# Altium project Beethoven-clock_Brain-PCB.PrjPcb
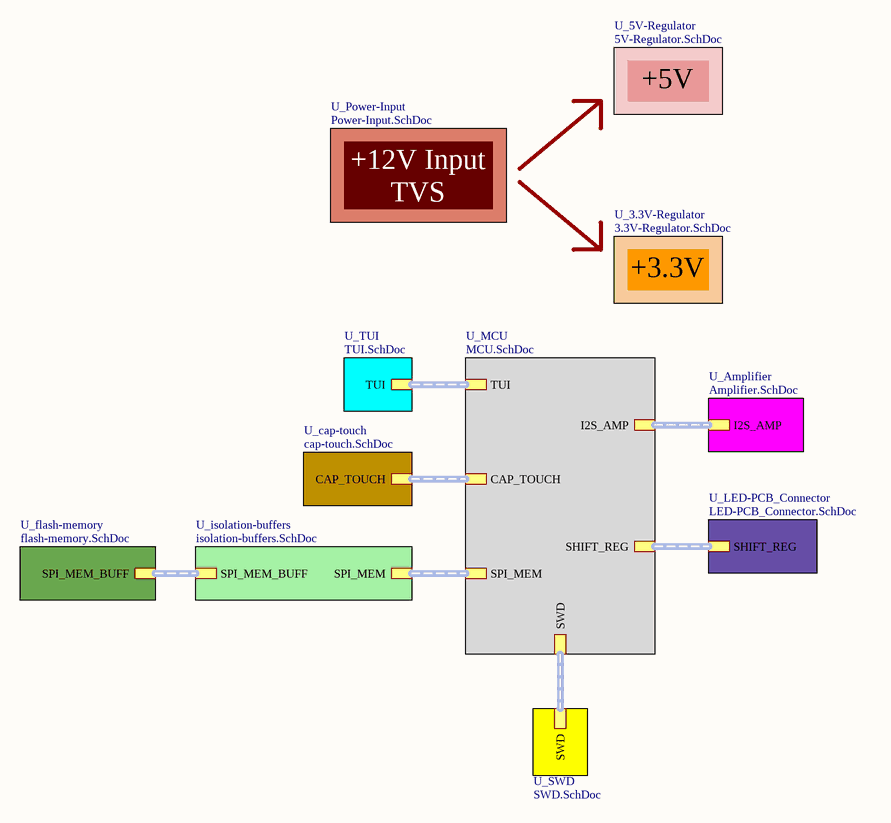
[diagram p0: Brain-PCB_MASTER.SchDoc]
12 sheets, 137 parts. Net scope: hierarchical (ports join the sheet entries above them; power ports are global).
Board file: Beethoven-Clock_Brain-PCB.PcbDoc
Sheets:
  Brain-PCB_MASTER.SchDoc
    U_cap-touch = Cap-Touch.SchDoc
    U_isolation-buffers = Isolation-Buffers.SchDoc
    U_flash-memory = Flash-Memory.SchDoc
    U_SWD = SWD.SchDoc
    U_TUI = TUI.SchDoc
    U_Power-Input = Power-Input.SchDoc
    U_3.3V-Regulator = 3.3V-Regulator.SchDoc
    U_5V-Regulator = 5V-Regulator.SchDoc
    U_LED-PCB_Connector = LED-PCB_Connector.SchDoc
    U_Amplifier = Amplifier.SchDoc
    U_MCU = MCU.SchDoc

## Sheet Brain-PCB_MASTER.SchDoc
size B; SheetNumber: 1; SheetTotal: 12

### Sub-sheets
U_3.3V-Regulator = 3.3V-Regulator.SchDoc: no entries
U_5V-Regulator = 5V-Regulator.SchDoc: no entries
U_Amplifier = Amplifier.SchDoc: I2S_AMP (harness I2S_AMP)
U_cap-touch = cap-touch.SchDoc: CAP_TOUCH (harness CAP_TOUCH)
U_flash-memory = flash-memory.SchDoc: SPI_MEM_BUFF (harness SPI_MEM_BUFF)
U_isolation-buffers = isolation-buffers.SchDoc: SPI_MEM (harness SPI_MEM), SPI_MEM_BUFF (harness SPI_MEM_BUFF)
U_LED-PCB_Connector = LED-PCB_Connector.SchDoc: SHIFT_REG (harness SHIFT_REG)
U_MCU = MCU.SchDoc: SPI_MEM (harness SPI_MEM), I2S_AMP (harness I2S_AMP), SHIFT_REG (harness SHIFT_REG), TUI (harness TUI), SWD (harness SWD), CAP_TOUCH (harness CAP_TOUCH)
U_Power-Input = Power-Input.SchDoc: no entries
U_SWD = SWD.SchDoc: SWD (harness SWD)
U_TUI = TUI.SchDoc: TUI (harness TUI)

### Buses and harness runs
harness sheet U_Amplifier/I2S_AMP = sheet U_MCU/I2S_AMP
harness sheet U_cap-touch/CAP_TOUCH = sheet U_MCU/CAP_TOUCH
harness sheet U_flash-memory/SPI_MEM_BUFF = sheet U_isolation-buffers/SPI_MEM_BUFF
harness sheet U_isolation-buffers/SPI_MEM = sheet U_MCU/SPI_MEM
harness sheet U_LED-PCB_Connector/SHIFT_REG = sheet U_MCU/SHIFT_REG
harness sheet U_MCU/SWD = sheet U_SWD/SWD
harness sheet U_MCU/TUI = sheet U_TUI/TUI

### Notes on the sheet
- +5V
- +12V Input
  TVS
- +3.3V

## Sheet Cap-Touch.SchDoc
size A; SheetNumber: 8; SheetTotal: 12
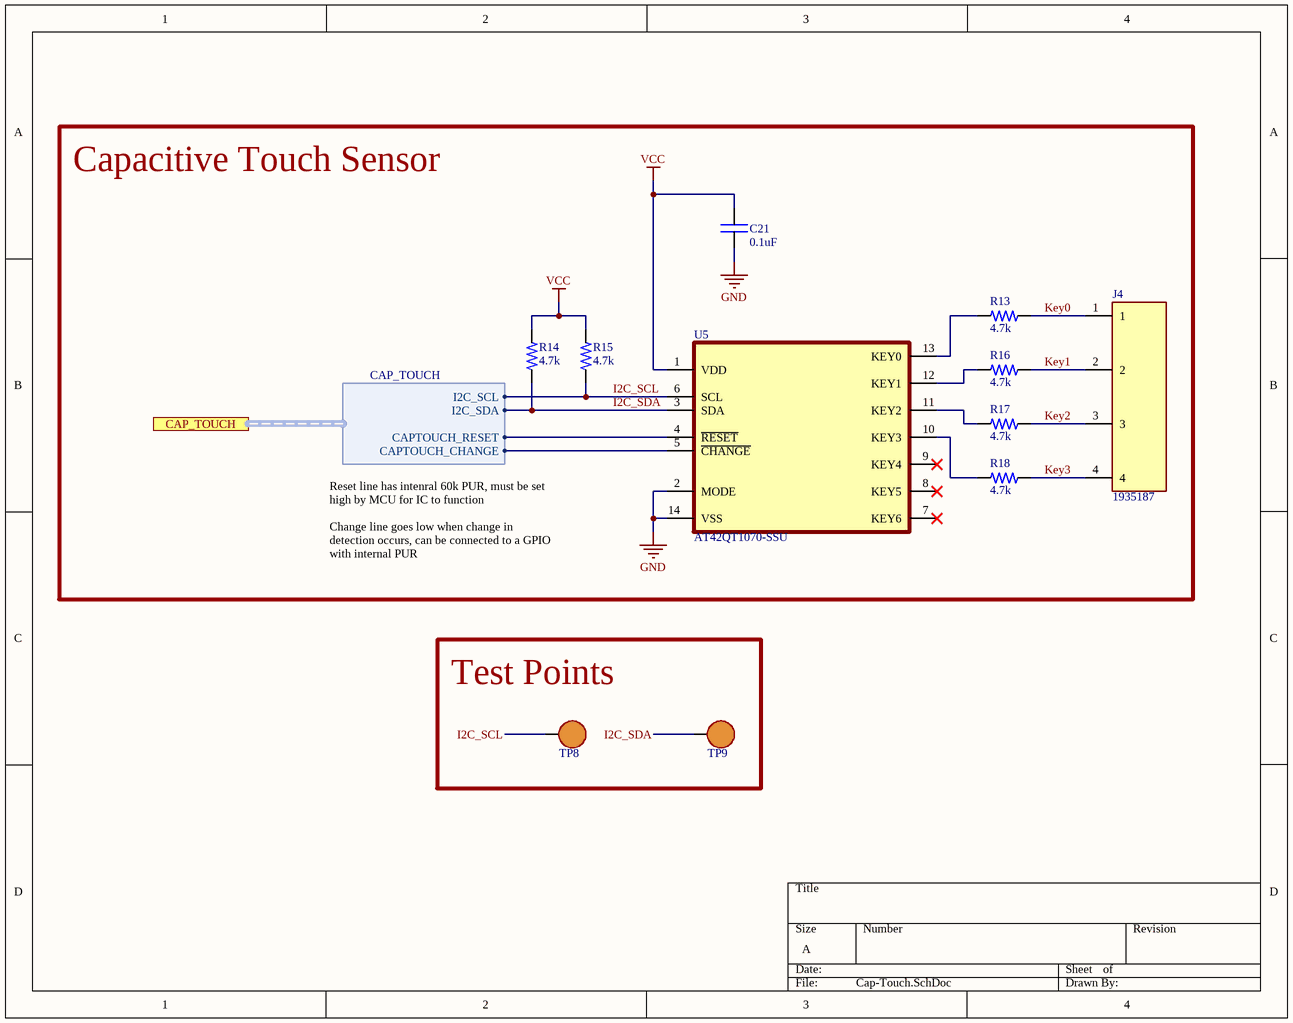
[diagram p1: Cap-Touch.SchDoc]

### Parts
C21  value 0.1uF  [0402C]  (hidden comment: CAP)
J4  1935187  [1935187]
R13  value 4.7k  [0402R]  (hidden comment: RES)
R14  value 4.7k  [0402R]  (hidden comment: RES)
R15  value 4.7k  [0402R]  (hidden comment: RES)
R16  value 4.7k  [0402R]  (hidden comment: RES)
R17  value 4.7k  [0402R]  (hidden comment: RES)
R18  value 4.7k  [0402R]  (hidden comment: RES)
TP8  RCWCTE  [RCWCTE]  (value not drawn)
TP9  RCWCTE  [RCWCTE]  (value not drawn)
U5  AT42QT1070-SSU  [14-SOIC]

### Blocks framed on the sheet
Capacitive Touch Sensor: C21 J4 R13-R18 U5
Test Points: TP8 TP9

### Ports
CAP_TOUCH (harness CAP_TOUCH, see Brain-PCB_MASTER[3B], MCU[1C])

### Harnesses
CAP_TOUCH: I2C_SCL, I2C_SDA, CAPTOUCH_RESET, CAPTOUCH_CHANGE

### Nets
GND: C21.1 U5.2(MODE) U5.14(VSS)
VCC: C21.2 R14.2 R15.2 U5.1(VDD)
CAPTOUCH_CHANGE: U5.5(~{CHANGE}) ; port CAP_TOUCH.CAPTOUCH_CHANGE
CAPTOUCH_RESET: U5.4(~{RESET}) ; port CAP_TOUCH.CAPTOUCH_RESET
I2C_SCL: R15.1 TP8.1 U5.6(SCL) ; port CAP_TOUCH.I2C_SCL
I2C_SDA: R14.1 TP9.1 U5.3(SDA) ; port CAP_TOUCH.I2C_SDA
Key0: J4.1 R13.1
Key1: J4.2 R16.1
Key2: J4.3 R17.1
Key3: J4.4 R18.1
NetR13_2: R13.2 U5.13(KEY0)
NetR16_2: R16.2 U5.12(KEY1)
NetR17_2: R17.2 U5.11(KEY2)
NetR18_2: R18.2 U5.10(KEY3)

Not connected (* = marked no-connect by the designer): U5 7(KEY6)* 8(KEY5)* 9(KEY4)*

### Notes on the sheet
- Reset line has intenral 60k PUR, must be set high by MCU for IC to function
  Change line goes low when change in detection occurs, can be connected to a GPIO with internal PUR

### Library data of the parts
C21 = CAP: Capacitor; MFR: Murata Electronics; MFR PN: GRM155R71C104KA88J; Type: SMD; Vendor: *; Vendor PN: *; Vendor Link: *
J4 = SCREW CONN 4 POS: Fixed Terminal Blocks PT 1.5/4-5.0-H; MFR: Phoenix Contact; MFR PN: 1935187; Type: TH
R13-R18 = RES: Resistor; MFR PN: AC0402FR-134K7L; MFR: YAGEO; Vendor: *; Vendor PN: *; Vendor Link: *; Type: SMD
TP8 TP9 = TEST POINT: Test Point, Surface Mount; MFR: KOA Speer Electronics, Inc.; MFR PN: RCWCTE; Type: SMD
U5 = AT42QT1070-SSU: Capacitive Touch Buttons 14-SOIC; MFR: Microchip; Value: *; MFR PN: AT42QT1070-SSU; Type: SMD

## Sheet Isolation-Buffers.SchDoc
size B; SheetNumber: 9; SheetTotal: 12
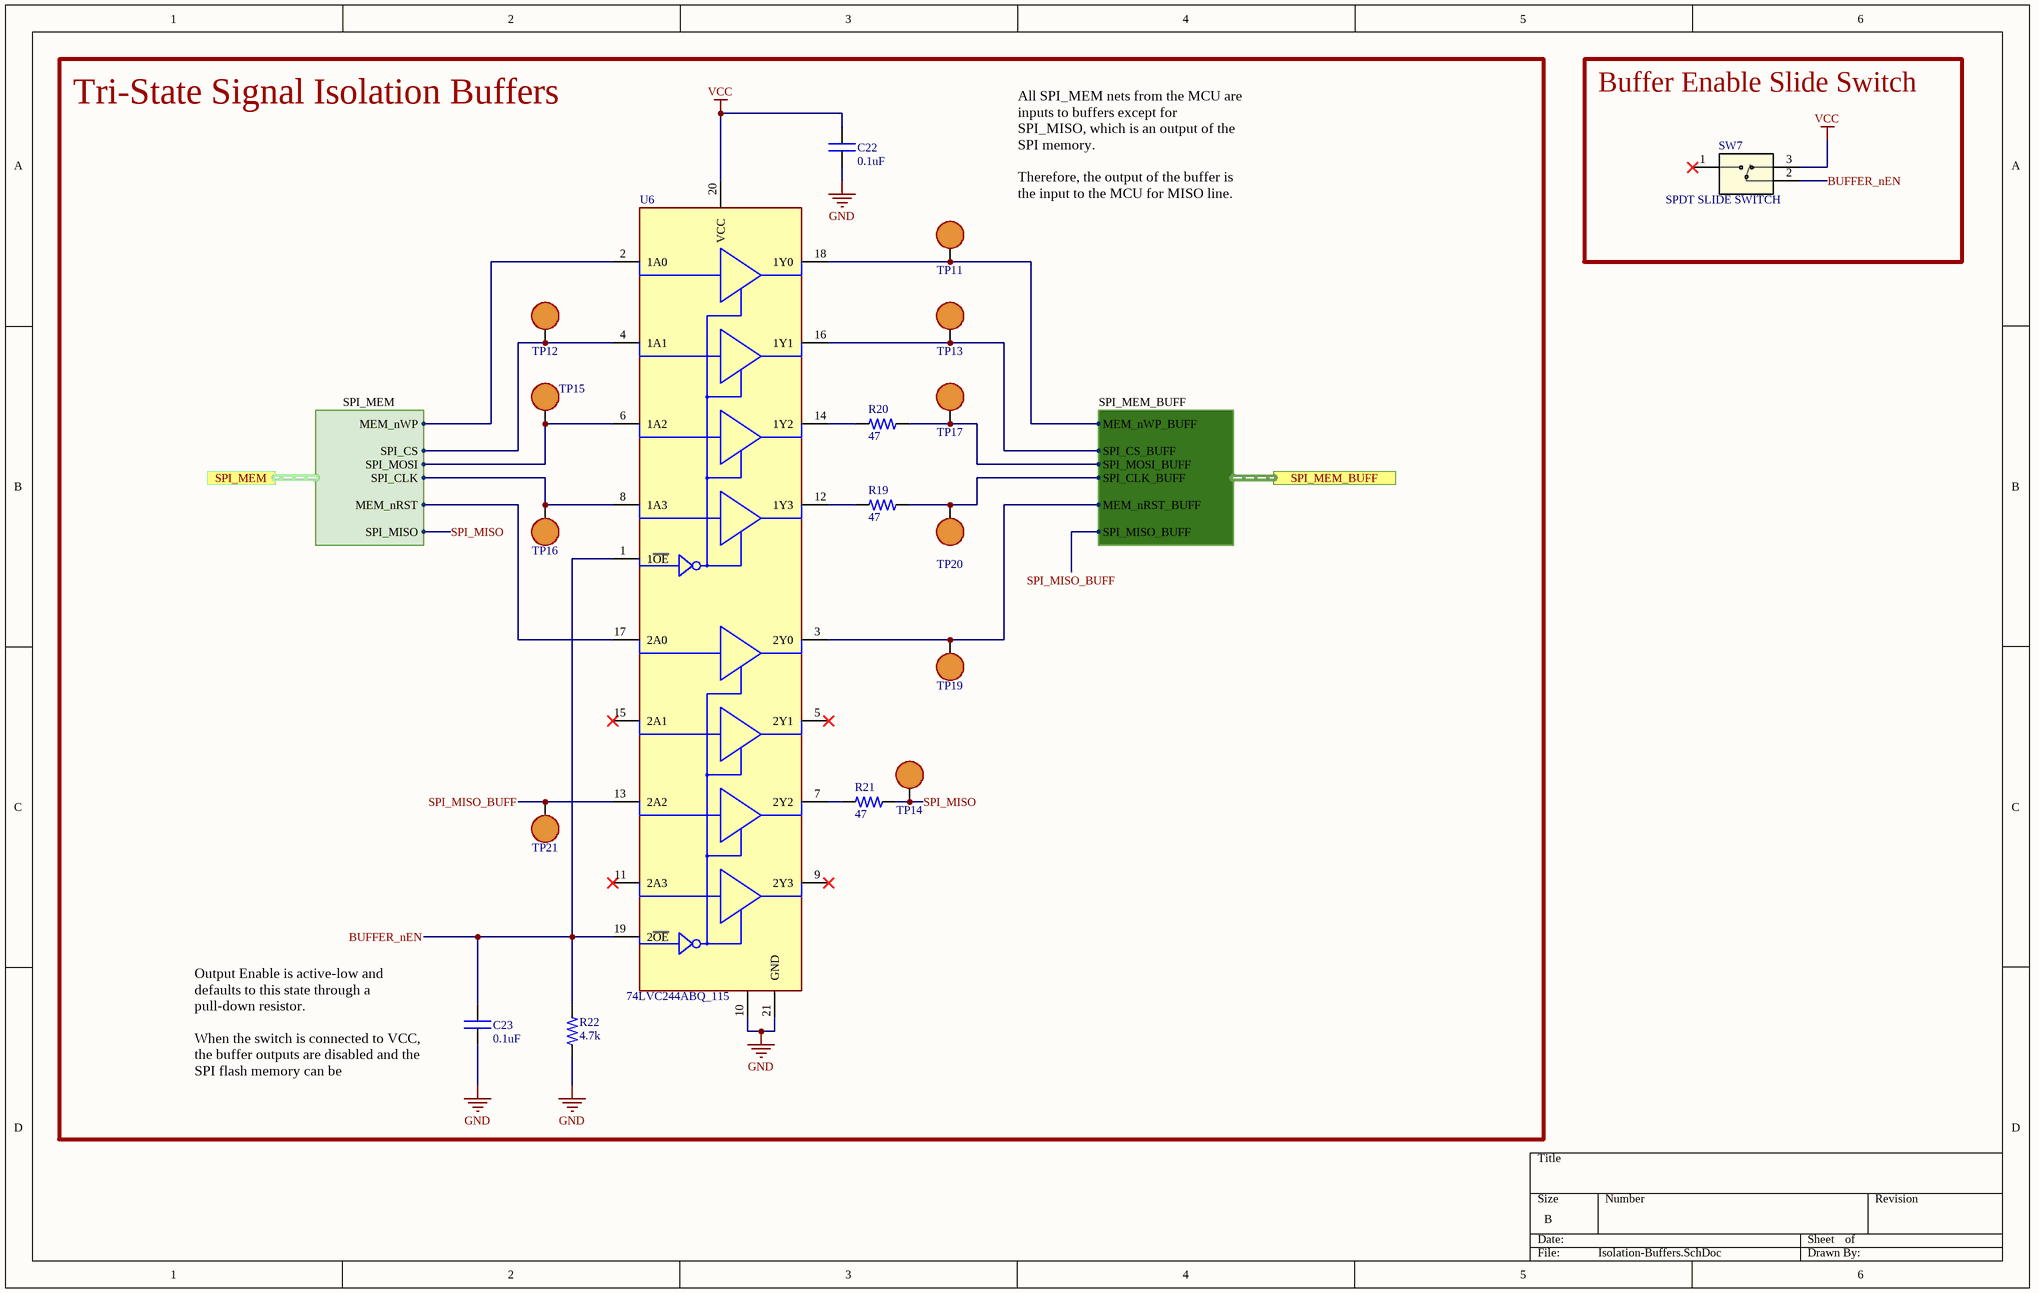
[diagram p2: Isolation-Buffers.SchDoc]

### Parts
C22  value 0.1uF  [0402C]  (hidden comment: CAP)
C23  value 0.1uF  [0402C]  (hidden comment: CAP)
R19  value 47  [0402R]  (hidden comment: RES)
R20  value 47  [0402R]  (hidden comment: RES)
R21  value 47  [0402R]  (hidden comment: RES)
R22  value 4.7k  [0402R]  (hidden comment: RES)
SW7  SPDT SLIDE SWITCH  [JS102011SCQN]
TP11  RCWCTE  [RCWCTE]  (value not drawn)
TP12  RCWCTE  [RCWCTE]  (value not drawn)
TP13  RCWCTE  [RCWCTE]  (value not drawn)
TP14  RCWCTE  [RCWCTE]  (value not drawn)
TP15  RCWCTE  [RCWCTE]  (value not drawn)
TP16  RCWCTE  [RCWCTE]  (value not drawn)
TP17  RCWCTE  [RCWCTE]  (value not drawn)
TP19  RCWCTE  [RCWCTE]  (value not drawn)
TP20  RCWCTE  [RCWCTE]  (value not drawn)
TP21  RCWCTE  [RCWCTE]  (value not drawn)
U6  74LVC244ABQ_115  [20-VFQN-EP]

### Blocks framed on the sheet
Tri-State Signal Isolation Buffers: C22 C23 R19-R22 TP11-TP17 TP19-TP21 U6
Buffer Enable Slide Switch: SW7

### Ports
SPI_MEM (harness SPI_MEM, see Brain-PCB_MASTER[3C], MCU[1A]), SPI_MEM_BUFF (harness SPI_MEM_BUFF, see Brain-PCB_MASTER[2C], Flash-Memory[4A])

### Harnesses
SPI_MEM: SPI_CLK, SPI_MISO, SPI_MOSI, SPI_CS, MEM_nWP, MEM_nRST
SPI_MEM_BUFF: SPI_CLK_BUFF, SPI_MISO_BUFF, SPI_MOSI_BUFF, SPI_CS_BUFF, MEM_nWP_BUFF, MEM_nRST_BUFF

### Nets
GND: C22.2 C23.1 R22.1 U6.10(GND) U6.21(GND)
VCC: C22.1 SW7.3 U6.20(VCC)
BUFFER_nEN: C23.2 R22.2 SW7.2 U6.1(1~{OE}) U6.19(2~{OE})
MEM_nRST: U6.17(2A0) ; port SPI_MEM.MEM_nRST
MEM_nRST_BUFF: TP19.1 U6.3(2Y0) ; port SPI_MEM_BUFF.MEM_nRST_BUFF
MEM_nWP: U6.2(1A0) ; port SPI_MEM.MEM_nWP
MEM_nWP_BUFF: TP11.1 U6.18(1Y0) ; port SPI_MEM_BUFF.MEM_nWP_BUFF
SPI_CLK: TP16.1 U6.8(1A3) ; port SPI_MEM.SPI_CLK
SPI_CLK_BUFF: R19.1 TP20.1 ; port SPI_MEM_BUFF.SPI_CLK_BUFF
SPI_CS: TP12.1 U6.4(1A1) ; port SPI_MEM.SPI_CS
SPI_CS_BUFF: TP13.1 U6.16(1Y1) ; port SPI_MEM_BUFF.SPI_CS_BUFF
SPI_MISO: R21.1 TP14.1 ; port SPI_MEM.SPI_MISO
SPI_MISO_BUFF: TP21.1 U6.13(2A2) ; port SPI_MEM_BUFF.SPI_MISO_BUFF
SPI_MOSI: TP15.1 U6.6(1A2) ; port SPI_MEM.SPI_MOSI
SPI_MOSI_BUFF: R20.1 TP17.1 ; port SPI_MEM_BUFF.SPI_MOSI_BUFF
NetR19_2: R19.2 U6.12(1Y3)
NetR20_2: R20.2 U6.14(1Y2)
NetR21_2: R21.2 U6.7(2Y2)

Not connected (* = marked no-connect by the designer): SW7 1*; U6 5(2Y1)* 9(2Y3)* 11(2A3)* 15(2A1)*

### Notes on the sheet
- All SPI_MEM nets from the MCU are inputs to buffers except for SPI_MISO, which is an output of the SPI memory.
  Therefore, the output of the buffer is the input to the MCU for MISO line.
- Output Enable is active-low and defaults to this state through a pull-down resistor.
  When the switch is connected to VCC, the buffer outputs are disabled and the SPI flash memory can be programmed.

### Library data of the parts
C22 C23 = CAP: as C21 on sheet Cap-Touch; Vendor: *; Vendor PN: *; Vendor Link: *
R19-R21 = RES: Resistor; MFR PN: RC0402FR-0747RL; MFR: YAGEO; Vendor: *; Vendor PN: *; Vendor Link: *; Type: SMD
R22 = RES: as R13 on sheet Cap-Touch; Vendor: *; Vendor PN: *; Vendor Link: *; Type: SMD
SW7 = SPDT SLIDE SWITCH: MFR: C&K; MFR PN: JS102011SCQN; Type: SMD
TP11-TP17 TP19-TP21 = TEST POINT: as TP8 on sheet Cap-Touch; MFR PN: RCWCTE; Type: SMD
U6 = TRI-STATE BUFFERS 8 CIRC: NXP 74LVC244ABQ,115 Octal Buffer & Line Driver, 3-State, 1.2  3.6 V, 20-Pin DHVQFN; MFR: Nexperia; MFR PN: 74LVC244ABQ,115; Value: *; Type: SMD

## Sheet Flash-Memory.SchDoc
size B; SheetNumber: 10; SheetTotal: 12
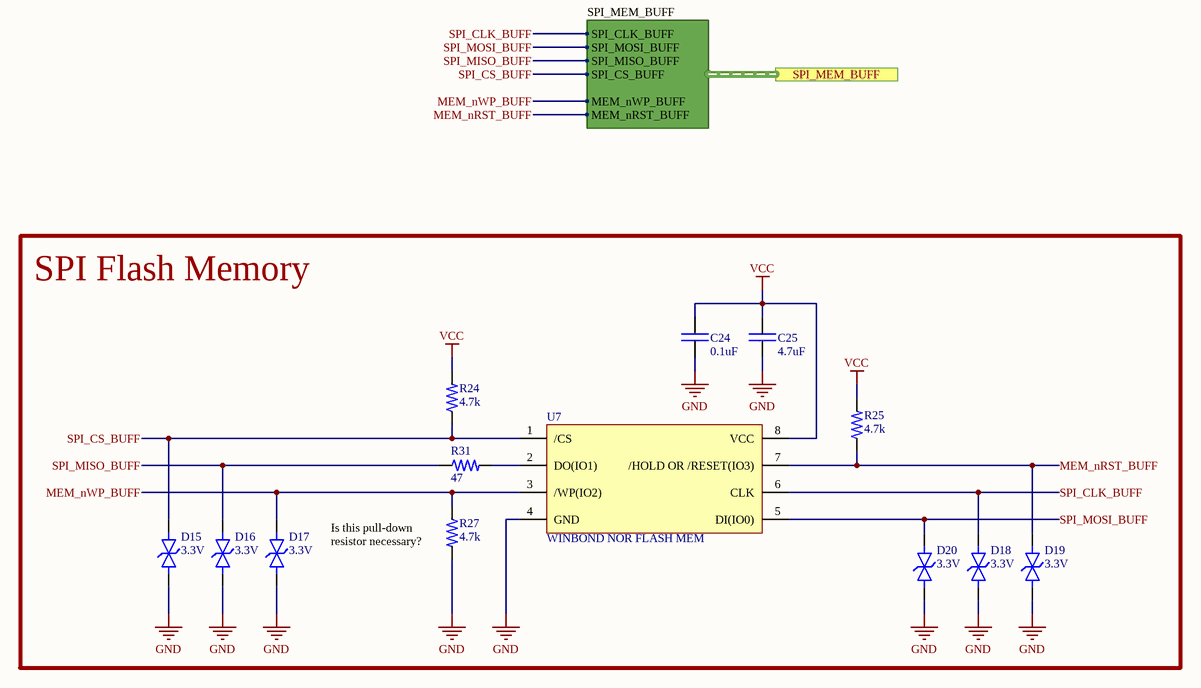
[diagram p3: Flash-Memory.SchDoc]

### Parts
C24  value 0.1uF  [0402C]  (hidden comment: CAP)
C25  value 4.7uF  [0402C]  (hidden comment: CAP)
D15  VRS: 3.3V  [0402-TVS]  (hidden comment: DESD3V3E1BL-7B)
D16  VRS: 3.3V  [0402-TVS]  (hidden comment: DESD3V3E1BL-7B)
D17  VRS: 3.3V  [0402-TVS]  (hidden comment: DESD3V3E1BL-7B)
D18  VRS: 3.3V  [0402-TVS]  (hidden comment: DESD3V3E1BL-7B)
D19  VRS: 3.3V  [0402-TVS]  (hidden comment: DESD3V3E1BL-7B)
D20  VRS: 3.3V  [0402-TVS]  (hidden comment: DESD3V3E1BL-7B)
R24  value 4.7k  [0402R]  (hidden comment: RES)
R25  value 4.7k  [0402R]  (hidden comment: RES)
R27  value 4.7k  [0402R]  (hidden comment: RES)
R31  value 47  [0402R]  (hidden comment: RES)
U7  WINBOND NOR FLASH MEM  [8-SOIC]

### Blocks framed on the sheet
SPI Flash Memory: C24 C25 D15-D20 R24 R25 R27 R31 U7

### Ports
SPI_MEM_BUFF (harness SPI_MEM_BUFF, see Brain-PCB_MASTER[2C], Isolation-Buffers[4B])

### Harnesses
SPI_MEM_BUFF: SPI_CLK_BUFF, SPI_MOSI_BUFF, SPI_MISO_BUFF, SPI_CS_BUFF, MEM_nWP_BUFF, MEM_nRST_BUFF

### Nets
GND: C24.1 C25.1 D15.2 D16.2 D17.2 D18.2 D19.2 D20.2 R27.2 U7.4(GND)
VCC: C24.2 C25.2 R24.2 R25.2 U7.8(VCC)
MEM_nRST_BUFF: D19.1 R25.1 U7.7(/HOLD_OR_/RESET(IO3)) ; port SPI_MEM_BUFF.MEM_nRST_BUFF
MEM_nWP_BUFF: D17.1 R27.1 U7.3(/WP(IO2)) ; port SPI_MEM_BUFF.MEM_nWP_BUFF
SPI_CLK_BUFF: D18.1 U7.6(CLK) ; port SPI_MEM_BUFF.SPI_CLK_BUFF
SPI_CS_BUFF: D15.1 R24.1 U7.1(/CS) ; port SPI_MEM_BUFF.SPI_CS_BUFF
SPI_MISO_BUFF: D16.1 R31.1 ; port SPI_MEM_BUFF.SPI_MISO_BUFF
SPI_MOSI_BUFF: D20.1 U7.5(DI(IO0)) ; port SPI_MEM_BUFF.SPI_MOSI_BUFF
NetR31_2: R31.2 U7.2(DO(IO1))

### Notes on the sheet
- (near R27) Is this pull-down resistor necessary?

### Library data of the parts
C24 = CAP: as C21 on sheet Cap-Touch; Vendor: *; Vendor PN: *; Vendor Link: *
C25 = CAP: Capacitor; MFR: Murata Electronics; MFR PN: GRM155D81C475ME15J; Type: SMD; Vendor: *; Vendor PN: *; Vendor Link: *
D15-D20 = TVS Diode 3.3V Bi: TVS DIODE 3.3VWM 7VC DFN1006-2; MFR: Diodes Incorporated; Type: SMD; VBR: 3.8V; VC: 7V; MFR PN: DESD3V3E1BL-7B
R24 R25 R27 = RES: as R13 on sheet Cap-Touch; Vendor: *; Vendor PN: *; Vendor Link: *; Type: SMD
R31 = RES: as R19 on sheet Isolation-Buffers; Vendor: *; Vendor PN: *; Vendor Link: *; Type: SMD
U7 = WINBOND NOR FLASH MEM: FLASH - NOR Memory IC SPI; MFR PN: W25Q128JVSIM; MFR: Winbond; Type: SMD; Value: *

## Sheet SWD.SchDoc
size A; SheetNumber: 6; SheetTotal: 12
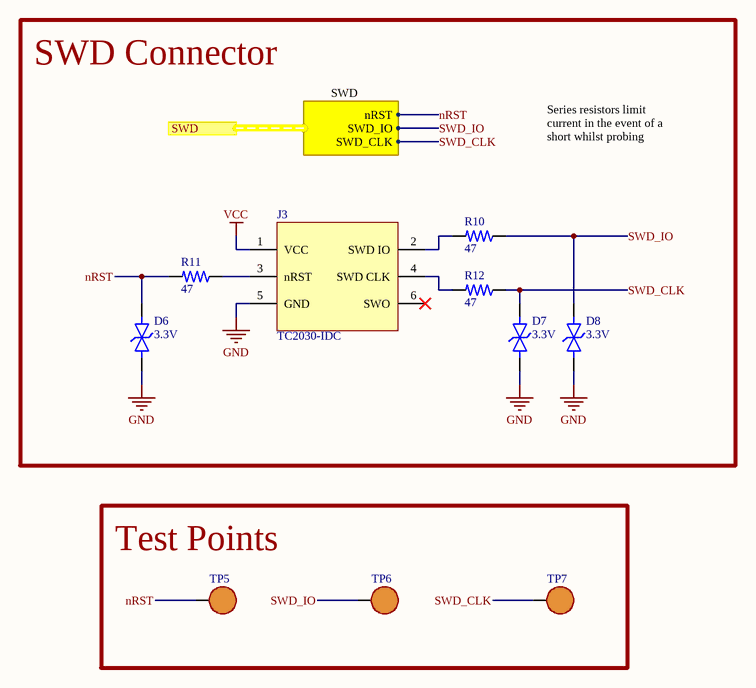
[diagram p4: SWD.SchDoc]

### Parts
D6  VRS: 3.3V  [0402-TVS]  (hidden comment: DESD3V3E1BL-7B)
D7  VRS: 3.3V  [0402-TVS]  (hidden comment: DESD3V3E1BL-7B)
D8  VRS: 3.3V  [0402-TVS]  (hidden comment: DESD3V3E1BL-7B)
J3  TC2030-IDC  [TAG CONNECT TC2030IDC - NO 3D MODEL]
R10  value 47  [0402R]  (hidden comment: RES)
R11  value 47  [0402R]  (hidden comment: RES)
R12  value 47  [0402R]  (hidden comment: RES)
TP5  RCWCTE  [RCWCTE]  (value not drawn)
TP6  RCWCTE  [RCWCTE]  (value not drawn)
TP7  RCWCTE  [RCWCTE]  (value not drawn)

### Blocks framed on the sheet
SWD Connector: D6-D8 J3 R10-R12
Test Points: TP5-TP7

### Ports
SWD (harness SWD, see Brain-PCB_MASTER[4C], MCU[1C])

### Harnesses
SWD: SWD_CLK, SWD_IO, nRST

### Nets
GND: D6.2 D7.2 D8.2 J3.5(GND)
VCC: J3.1(VCC)
nRST: D6.1 R11.2 TP5.1 ; port SWD.nRST
SWD_CLK: D7.1 R12.1 TP7.1 ; port SWD.SWD_CLK
SWD_IO: D8.1 R10.1 TP6.1 ; port SWD.SWD_IO
NetJ3_2: J3.2(SWD_IO) R10.2
NetJ3_3: J3.3(nRST) R11.1
NetJ3_4: J3.4(SWD_CLK) R12.2

Not connected (* = marked no-connect by the designer): J3 6(SWO)*

### Notes on the sheet
- Series resistors limit current in the event of a short whilst probing

### Library data of the parts
D6-D8 = TVS Diode 3.3V Bi: as D15 on sheet Flash-Memory; MFR PN: DESD3V3E1BL-7B
J3 = TC2030-IDC: "Plug of Nails" POGO Pin connector; MFR PN: TC2030-IDC-NL; MFR: Tag-Connect; Value: DNS
R10-R12 = RES: as R19 on sheet Isolation-Buffers; Vendor: *; Vendor PN: *; Vendor Link: *; Type: SMD
TP5-TP7 = TEST POINT: as TP8 on sheet Cap-Touch; MFR PN: RCWCTE; Type: SMD

## Sheet TUI.SchDoc
size A; SheetNumber: 7; SheetTotal: 12
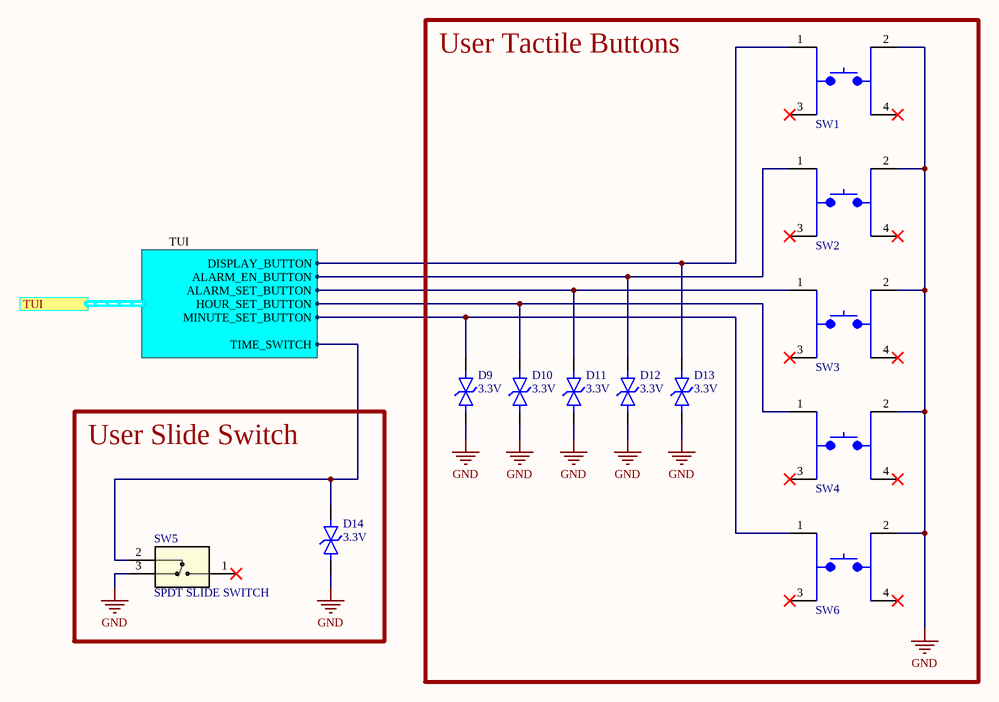
[diagram p5: TUI.SchDoc]

### Parts
D9  VRS: 3.3V  [0402-TVS]  (hidden comment: DESD3V3E1BL-7B)
D10  VRS: 3.3V  [0402-TVS]  (hidden comment: DESD3V3E1BL-7B)
D11  VRS: 3.3V  [0402-TVS]  (hidden comment: DESD3V3E1BL-7B)
D12  VRS: 3.3V  [0402-TVS]  (hidden comment: DESD3V3E1BL-7B)
D13  VRS: 3.3V  [0402-TVS]  (hidden comment: DESD3V3E1BL-7B)
D14  VRS: 3.3V  [0402-TVS]  (hidden comment: DESD3V3E1BL-7B)
SW1  SPDT PUSH BUTTON SWITCH  [430152080826]  (value not drawn)
SW2  SPDT PUSH BUTTON SWITCH  [430152080826]  (value not drawn)
SW3  SPDT PUSH BUTTON SWITCH  [430152080826]  (value not drawn)
SW4  SPDT PUSH BUTTON SWITCH  [430152080826]  (value not drawn)
SW5  SPDT SLIDE SWITCH  [JS102011SCQN]
SW6  SPDT PUSH BUTTON SWITCH  [430152080826]  (value not drawn)

### Blocks framed on the sheet
User Tactile Buttons: D9-D13 SW1-SW4 SW6
User Slide Switch: D14 SW5

### Ports
TUI (harness TUI, see Brain-PCB_MASTER[3B], MCU[1C])

### Harnesses
TUI: TIME_SWITCH, DISPLAY_BUTTON, ALARM_EN_BUTTON, MINUTE_SET_BUTTON, HOUR_SET_BUTTON, ALARM_SET_BUTTON

### Nets
GND: D9.2 D10.2 D11.2 D12.2 D13.2 D14.2 SW1.2 SW2.2 SW3.2 SW4.2 SW5.3 SW6.2
ALARM_EN_BUTTON: D12.1 SW2.1 ; port TUI.ALARM_EN_BUTTON
ALARM_SET_BUTTON: D11.1 SW3.1 ; port TUI.ALARM_SET_BUTTON
DISPLAY_BUTTON: D13.1 SW1.1 ; port TUI.DISPLAY_BUTTON
HOUR_SET_BUTTON: D10.1 SW4.1 ; port TUI.HOUR_SET_BUTTON
MINUTE_SET_BUTTON: D9.1 SW6.1 ; port TUI.MINUTE_SET_BUTTON
TIME_SWITCH: D14.1 SW5.2 ; port TUI.TIME_SWITCH

Not connected (* = marked no-connect by the designer): SW1 3* 4*; SW2 3* 4*; SW3 3* 4*; SW4 3* 4*; SW5 1*; SW6 3* 4*

### Library data of the parts
D9-D14 = TVS Diode 3.3V Bi: as D15 on sheet Flash-Memory; MFR PN: DESD3V3E1BL-7B
SW1-SW4 SW6 = SPDT PUSH BUTTON SWITCH: SWITCH TACTILE SPST-NO 0.05A 12V; MFR: Würth Elektronik; MFR PN: 430152095826; Type: SMD
SW5 = SPDT SLIDE SWITCH: MFR: C&K; MFR PN: JS102011SCQN; Type: SMD

## Sheet Power-Input.SchDoc
size A; SheetNumber: 2; SheetTotal: 12
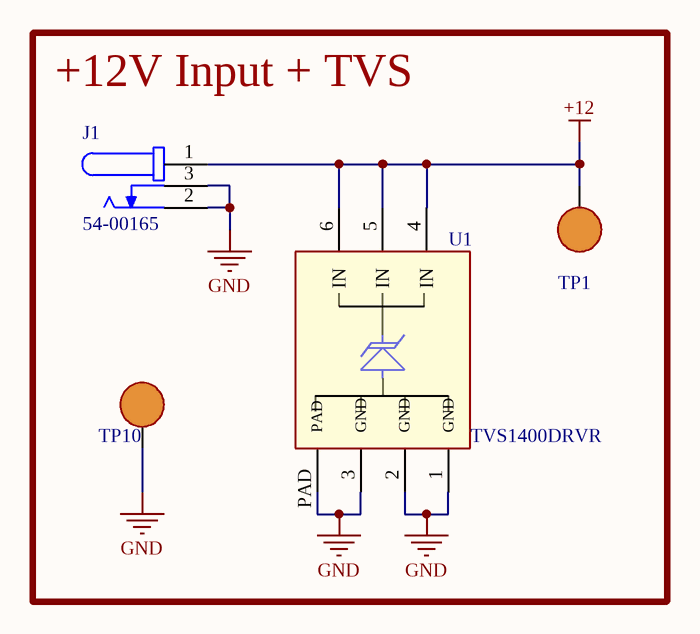
[diagram p6: Power-Input.SchDoc]

### Parts
J1  54-00165  [TENSILITY_54-00165]
TP1  RCWCTE  [RCWCTE]  (value not drawn)
TP10  RCWCTE  [RCWCTE]  (value not drawn)
U1  TVS1400DRVR  [6-WDFN-EP]

### Blocks framed on the sheet
+12V Input + TVS: J1 TP1 TP10 U1

### Nets
+12: J1.1(A) TP1.1 U1.4(IN) U1.5(IN) U1.6(IN)
GND: J1.2 J1.3 TP10.1 U1.1(GND) U1.2(GND) U1.3(GND) U1.PAD

### Library data of the parts
J1 = BARREL JACK 2.5MM ID 5.5MM OD: Connector, dc jack 5.5x2.5 mm, PCB mount, 90 degrees, silver plated, PA9T, SMT; MFR: Same Sky; MFR PN: PJ-002BH-SMT-TR; Type: SMD
TP1 TP10 = TEST POINT: as TP8 on sheet Cap-Touch; MFR PN: RCWCTE; Type: SMD
U1 = TVS1400DRVR: UNIDIR  PRECISION SURGE DIODE; MFR: Texas Instruments; MFR PN: TVS1400DRVR; Value: *; Type: SMD

## Sheet 3.3V-Regulator.SchDoc
size A; SheetNumber: 4; SheetTotal: 12
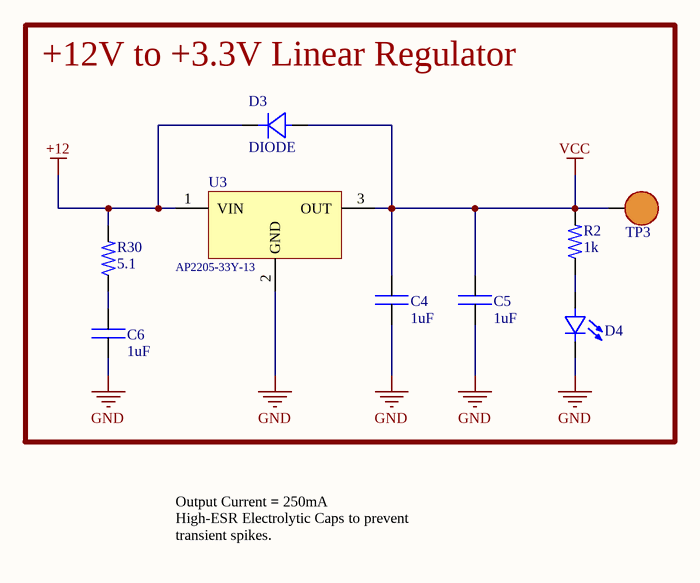
[diagram p7: 3.3V-Regulator.SchDoc]

### Parts
C4  value 1uF  [0402C]  (hidden comment: CAP)
C5  value 1uF  [0402C]  (hidden comment: CAP)
C6  value 1uF  [0402C]  (hidden comment: CAP)
D3  DIODE  [DO-214AC]
D4  LED - single  [LED - 0603]  (value not drawn)
R2  value 1k  [0402R]  (hidden comment: RES)
R30  value 5.1  [0805R]  (hidden comment: RES)
TP3  RCWCTE  [RCWCTE]  (value not drawn)
U3  AP2205-33Y-13  [SOT-89-3]

### Blocks framed on the sheet
+12V to +3.3V Linear Regulator: C4-C6 D3 D4 R2 R30 TP3 U3

### Nets
+12: D3.K R30.2 U3.1(VIN)
GND: C4.1 C5.1 C6.1 D4.2(C) U3.2(GND)
VCC: C4.2 C5.2 D3.A R2.2 TP3.1 U3.3(OUT)
NetC6_2: C6.2 R30.1
NetD4_1: D4.1(A) R2.1

### Notes on the sheet
- Output Current = 250mA
  High-ESR Electrolytic Caps to prevent transient spikes.

### Library data of the parts
C4-C6 = CAP: Capacitor; MFR: Murata Electronics; MFR PN: GRM155R61E105MA12D; Type: SMD; Vendor: *; Vendor PN: *; Vendor Link: *
D3 = DIODE: DIODE GEN PURP; MFR: Micro Commercial Co; MFR PN: GS1M-LTP; Type: SMD; Value: *
D4 = LED - single: LED; MFR: DNS; Type: SMD; Color: *; MFR PN: DNS
R2 = RES: Resistor; MFR PN: RC0402JR-071KL; MFR: YAGEO; Vendor: *; Vendor PN: *; Vendor Link: *; Type: SMD
R30 = RES: Resistor; MFR PN: ESR10EZPJ5R1; MFR: Rohm Semiconductor; Vendor: *; Vendor PN: *; Vendor Link: *; Type: SMD
TP3 = TEST POINT: as TP8 on sheet Cap-Touch; MFR PN: RCWCTE; Type: SMD
U3 = LIN REG 3.3V 250mA 24V: IC REG LINEAR 3.3V 250MA SOT89-3; MFR: Diodes Incorporated; MFR PN: AP2205-33Y-13; Type: SMD

## Sheet 5V-Regulator.SchDoc
size A; SheetNumber: 3; SheetTotal: 12
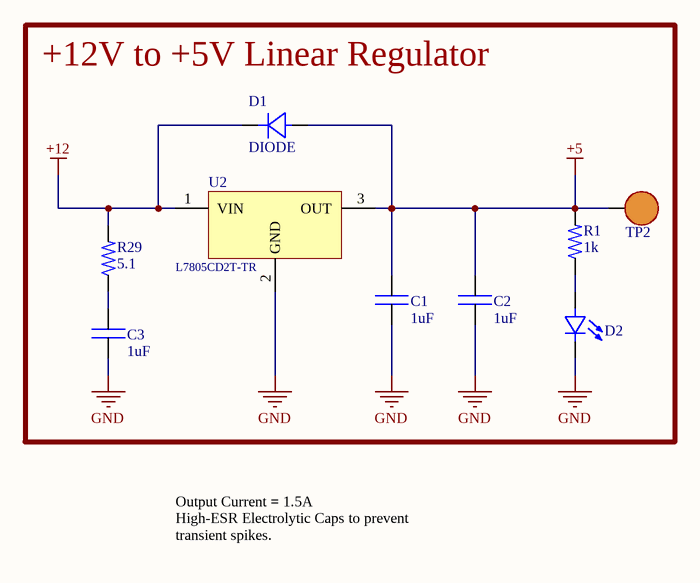
[diagram p8: 5V-Regulator.SchDoc]

### Parts
C1  value 1uF  [0402C]  (hidden comment: CAP)
C2  value 1uF  [0402C]  (hidden comment: CAP)
C3  value 1uF  [0402C]  (hidden comment: CAP)
D1  DIODE  [DO-214AC]
D2  LED - single  [LED - 0603]  (value not drawn)
R1  value 1k  [0402R]  (hidden comment: RES)
R29  value 5.1  [0805R]  (hidden comment: RES)
TP2  RCWCTE  [RCWCTE]  (value not drawn)
U2  L7805CD2T-TR  [D2PAK]

### Blocks framed on the sheet
+12V to +5V Linear Regulator: C1-C3 D1 D2 R1 R29 TP2 U2

### Nets
+5: C1.2 C2.2 D1.A R1.2 TP2.1 U2.3(OUT)
+12: D1.K R29.2 U2.1(VIN)
GND: C1.1 C2.1 C3.1 D2.2(C) U2.2(GND)
NetC3_2: C3.2 R29.1
NetD2_1: D2.1(A) R1.1

### Notes on the sheet
- Output Current = 1.5A
  High-ESR Electrolytic Caps to prevent transient spikes.

### Library data of the parts
C1-C3 = CAP: as C4 on sheet 3.3V-Regulator; Vendor: *; Vendor PN: *; Vendor Link: *
D1 = DIODE: as D3 on sheet 3.3V-Regulator; Value: *
D2 = LED - single: LED; MFR: DNS; Type: SMD; Color: *; MFR PN: DNS
R1 = RES: as R2 on sheet 3.3V-Regulator; Vendor: *; Vendor PN: *; Vendor Link: *; Type: SMD
R29 = RES: as R30 on sheet 3.3V-Regulator; Vendor: *; Vendor PN: *; Vendor Link: *; Type: SMD
TP2 = TEST POINT: as TP8 on sheet Cap-Touch; MFR PN: RCWCTE; Type: SMD
U2 = LIN REG 5V 1.5A 35V: Linear Voltage Regulator IC Positive Fixed 1 Output 1.5A D2PAK; MFR: STMicroelectronics; MFR PN: L7805CD2T-TR; Type: SMD

## Sheet LED-PCB_Connector.SchDoc
size A; SheetNumber: 12; SheetTotal: 12
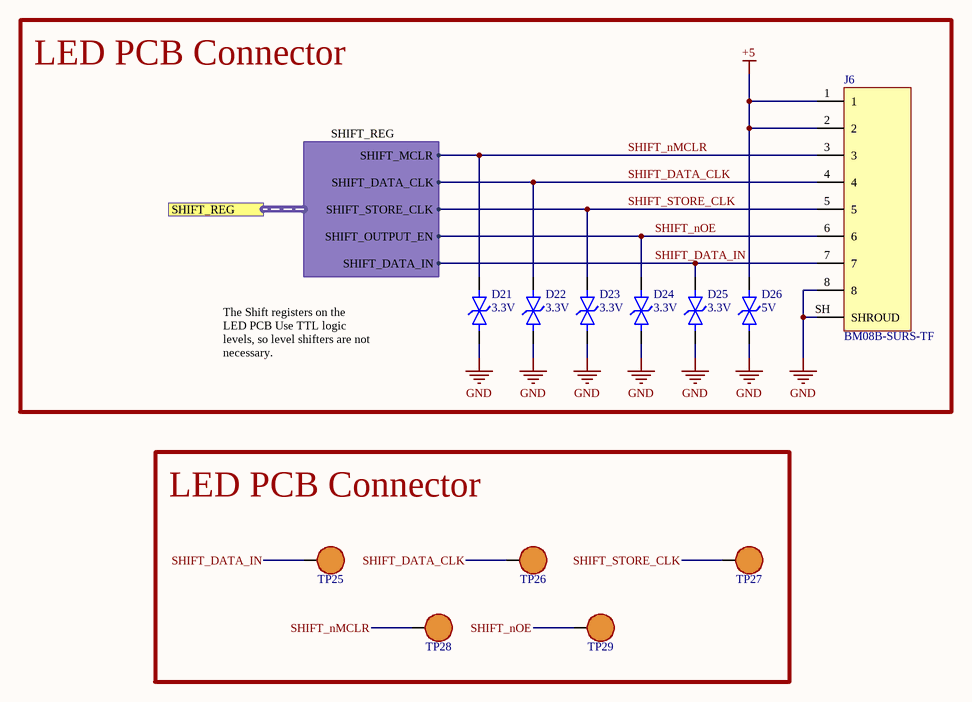
[diagram p9: LED-PCB_Connector.SchDoc]

### Parts
D21  VRS: 3.3V  [0402-TVS]  (hidden comment: DESD3V3E1BL-7B)
D22  VRS: 3.3V  [0402-TVS]  (hidden comment: DESD3V3E1BL-7B)
D23  VRS: 3.3V  [0402-TVS]  (hidden comment: DESD3V3E1BL-7B)
D24  VRS: 3.3V  [0402-TVS]  (hidden comment: DESD3V3E1BL-7B)
D25  VRS: 3.3V  [0402-TVS]  (hidden comment: DESD3V3E1BL-7B)
D26  VRS: 5V  [0402-TVS]  (hidden comment: DESD5V0U1BL-7B)
J6  BM08B-SURS-TF  [JST_BM08B-SURS-TF(LF)(SN)]
TP25  RCWCTE  [RCWCTE]  (value not drawn)
TP26  RCWCTE  [RCWCTE]  (value not drawn)
TP27  RCWCTE  [RCWCTE]  (value not drawn)
TP28  RCWCTE  [RCWCTE]  (value not drawn)
TP29  RCWCTE  [RCWCTE]  (value not drawn)

### Blocks framed on the sheet
LED PCB Connector: D21-D26 J6
LED PCB Connector: TP25-TP29

### Ports
SHIFT_REG (harness SHIFT_REG, see Brain-PCB_MASTER[4C], MCU[1B])

### Harnesses
SHIFT_REG: SHIFT_MCLR, SHIFT_STORE_CLK, SHIFT_DATA_IN, SHIFT_DATA_CLK, SHIFT_OUTPUT_EN

### Nets
+5: D26.1 J6.1 J6.2
GND: D21.2 D22.2 D23.2 D24.2 D25.2 D26.2 J6.8 J6.SH(SHROUD)
SHIFT_DATA_CLK: D22.1 J6.4 TP26.1 ; port SHIFT_REG.SHIFT_DATA_CLK
SHIFT_DATA_IN: D25.1 J6.7 TP25.1 ; port SHIFT_REG.SHIFT_DATA_IN
SHIFT_nMCLR: D21.1 J6.3 TP28.1 ; port SHIFT_REG.SHIFT_MCLR  [project net SHIFT_MCLR]
SHIFT_nOE: D24.1 J6.6 TP29.1 ; port SHIFT_REG.SHIFT_OUTPUT_EN
SHIFT_STORE_CLK: D23.1 J6.5 TP27.1 ; port SHIFT_REG.SHIFT_STORE_CLK

### Notes on the sheet
- The Shift registers on the LED PCB Use TTL logic levels, so level shifters are not necessary.

### Library data of the parts
D21-D25 = TVS Diode 3.3V Bi: as D15 on sheet Flash-Memory; MFR PN: DESD3V3E1BL-7B
D26 = TVS Diode 5V Bi: TVS DIODE 5VWM 7.2VC DFN1006-2; MFR: Diodes Incorporated; Type: SMD; VBR: 5.5V; VC: 7.2V; MFR PN: DESD5V0U1BL-7B
J6 = CONN 8POS 0.8MM PITCH: CONN HEADER SMD 8POS 0.8MM; MFR: JST; MFR PN: BM08B-SURS-TF; Type: SMD
TP25-TP29 = TEST POINT: as TP8 on sheet Cap-Touch; MFR PN: RCWCTE; Type: SMD

## Sheet Amplifier.SchDoc
size A; SheetNumber: 11; SheetTotal: 12
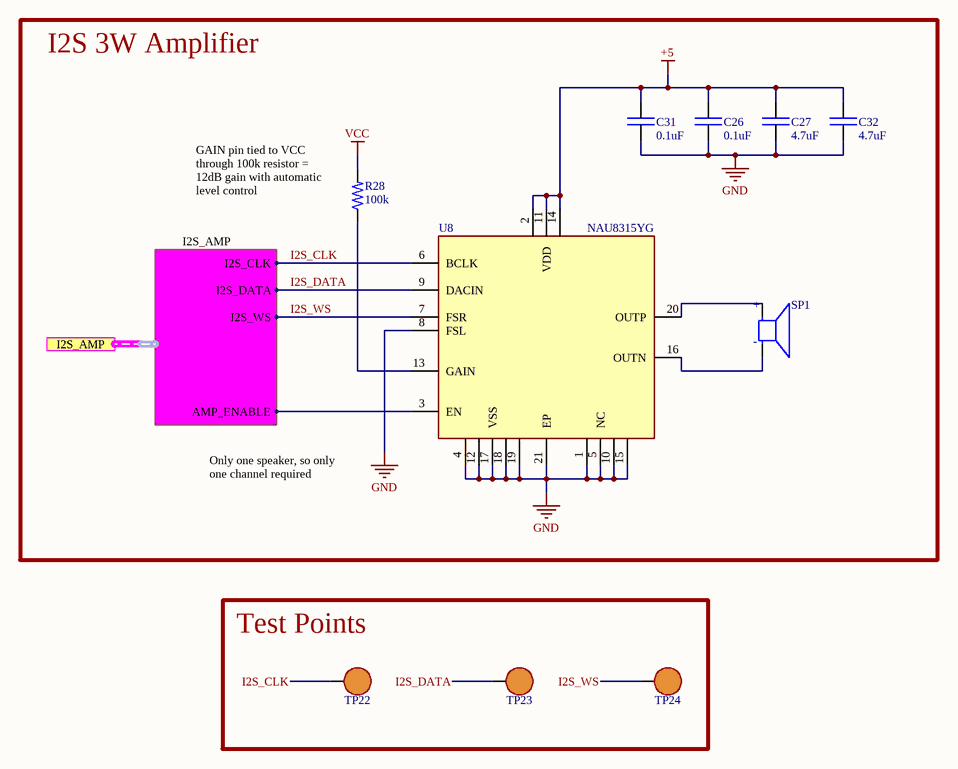
[diagram p10: Amplifier.SchDoc]

### Parts
C26  value 0.1uF  [0402C]  (hidden comment: CAP)
C27  value 4.7uF  [0402C]  (hidden comment: CAP)
C31  value 0.1uF  [0402C]  (hidden comment: CAP)
C32  value 4.7uF  [0402C]  (hidden comment: CAP)
R28  value 100k  [0402R]  (hidden comment: RES)
SP1  AS07104PO-LW152-R  [26AWG_AS04004PO-2-LW152-R_SideMount]  (value not drawn)
TP22  RCWCTE  [RCWCTE]  (value not drawn)
TP23  RCWCTE  [RCWCTE]  (value not drawn)
TP24  RCWCTE  [RCWCTE]  (value not drawn)
U8  NAU8315YG  [20-WFQFN-EP]

### Blocks framed on the sheet
I2S 3W Amplifier: C26 C27 C31 C32 R28 SP1 U8
Test Points: TP22-TP24

### Ports
I2S_AMP (harness I2S_AMP, see Brain-PCB_MASTER[4B], MCU[1B])

### Harnesses
I2S_AMP: I2S_CLK, I2S_DATA, I2S_WS, AMP_ENABLE

### Nets
+5: C26.2 C27.2 C31.2 C32.2 U8.2(VDD) U8.11(VDD) U8.14(VDD)
GND: C26.1 C27.1 C31.1 C32.1 U8.1(NC) U8.4(VSS) U8.5(NC) U8.8(FSL) U8.10(NC) U8.12(VSS) U8.15(NC) U8.17(VSS) U8.18(VSS) U8.19(VSS) U8.21(EP)
VCC: R28.2
AMP_ENABLE: U8.3(EN) ; port I2S_AMP.AMP_ENABLE
I2S_CLK: TP22.1 U8.6(BCLK) ; port I2S_AMP.I2S_CLK
I2S_DATA: TP23.1 U8.9(DACIN) ; port I2S_AMP.I2S_DATA
I2S_WS: TP24.1 U8.7(FSR) ; port I2S_AMP.I2S_WS
NetR28_1: R28.1 U8.13(GAIN)
NetSP1_N: SP1.N U8.16(OUTN)
NetSP1_P: SP1.P U8.20(OUTP)

### Notes on the sheet
- (near R28) GAIN pin tied to VCC through 100k resistor = 12dB gain with automatic level control
- Only one speaker, so only one channel required
- (in symbol SPEAKER 4OHM 3W) +; -

### Library data of the parts
C26 C31 = CAP: as C21 on sheet Cap-Touch; Vendor: *; Vendor PN: *; Vendor Link: *
C27 C32 = CAP: as C25 on sheet Flash-Memory; Vendor: *; Vendor PN: *; Vendor Link: *
R28 = RES: Resistor; MFR PN: RC0402FR-07100KL; MFR: YAGEO; Tolerance: +/- 5%; Vendor: *; Vendor PN: *; Vendor Link: *; Type: SMD
SP1 = SPEAKER 4OHM 3W: SPEAKER 4OHM 3W TOP PORT 86DB; MFR: PUI Audio, Inc.; MFR PN: AS04004PO-2-LW152-R; Type: TH; Power Rating: 3W
TP22-TP24 = TEST POINT: as TP8 on sheet Cap-Touch; MFR PN: RCWCTE; Type: SMD
U8 = I2S 3W AMP: I2S MONO 3.2W CLASS-D AMPLIFIER; MFR: Nuvoton; MFR PN: NAU8315YG; Value: *; Type: SMD; Power Rating: 3.2W

## Sheet MCU.SchDoc
size 381 x 241 mm; SheetNumber: 5; SheetTotal: 12
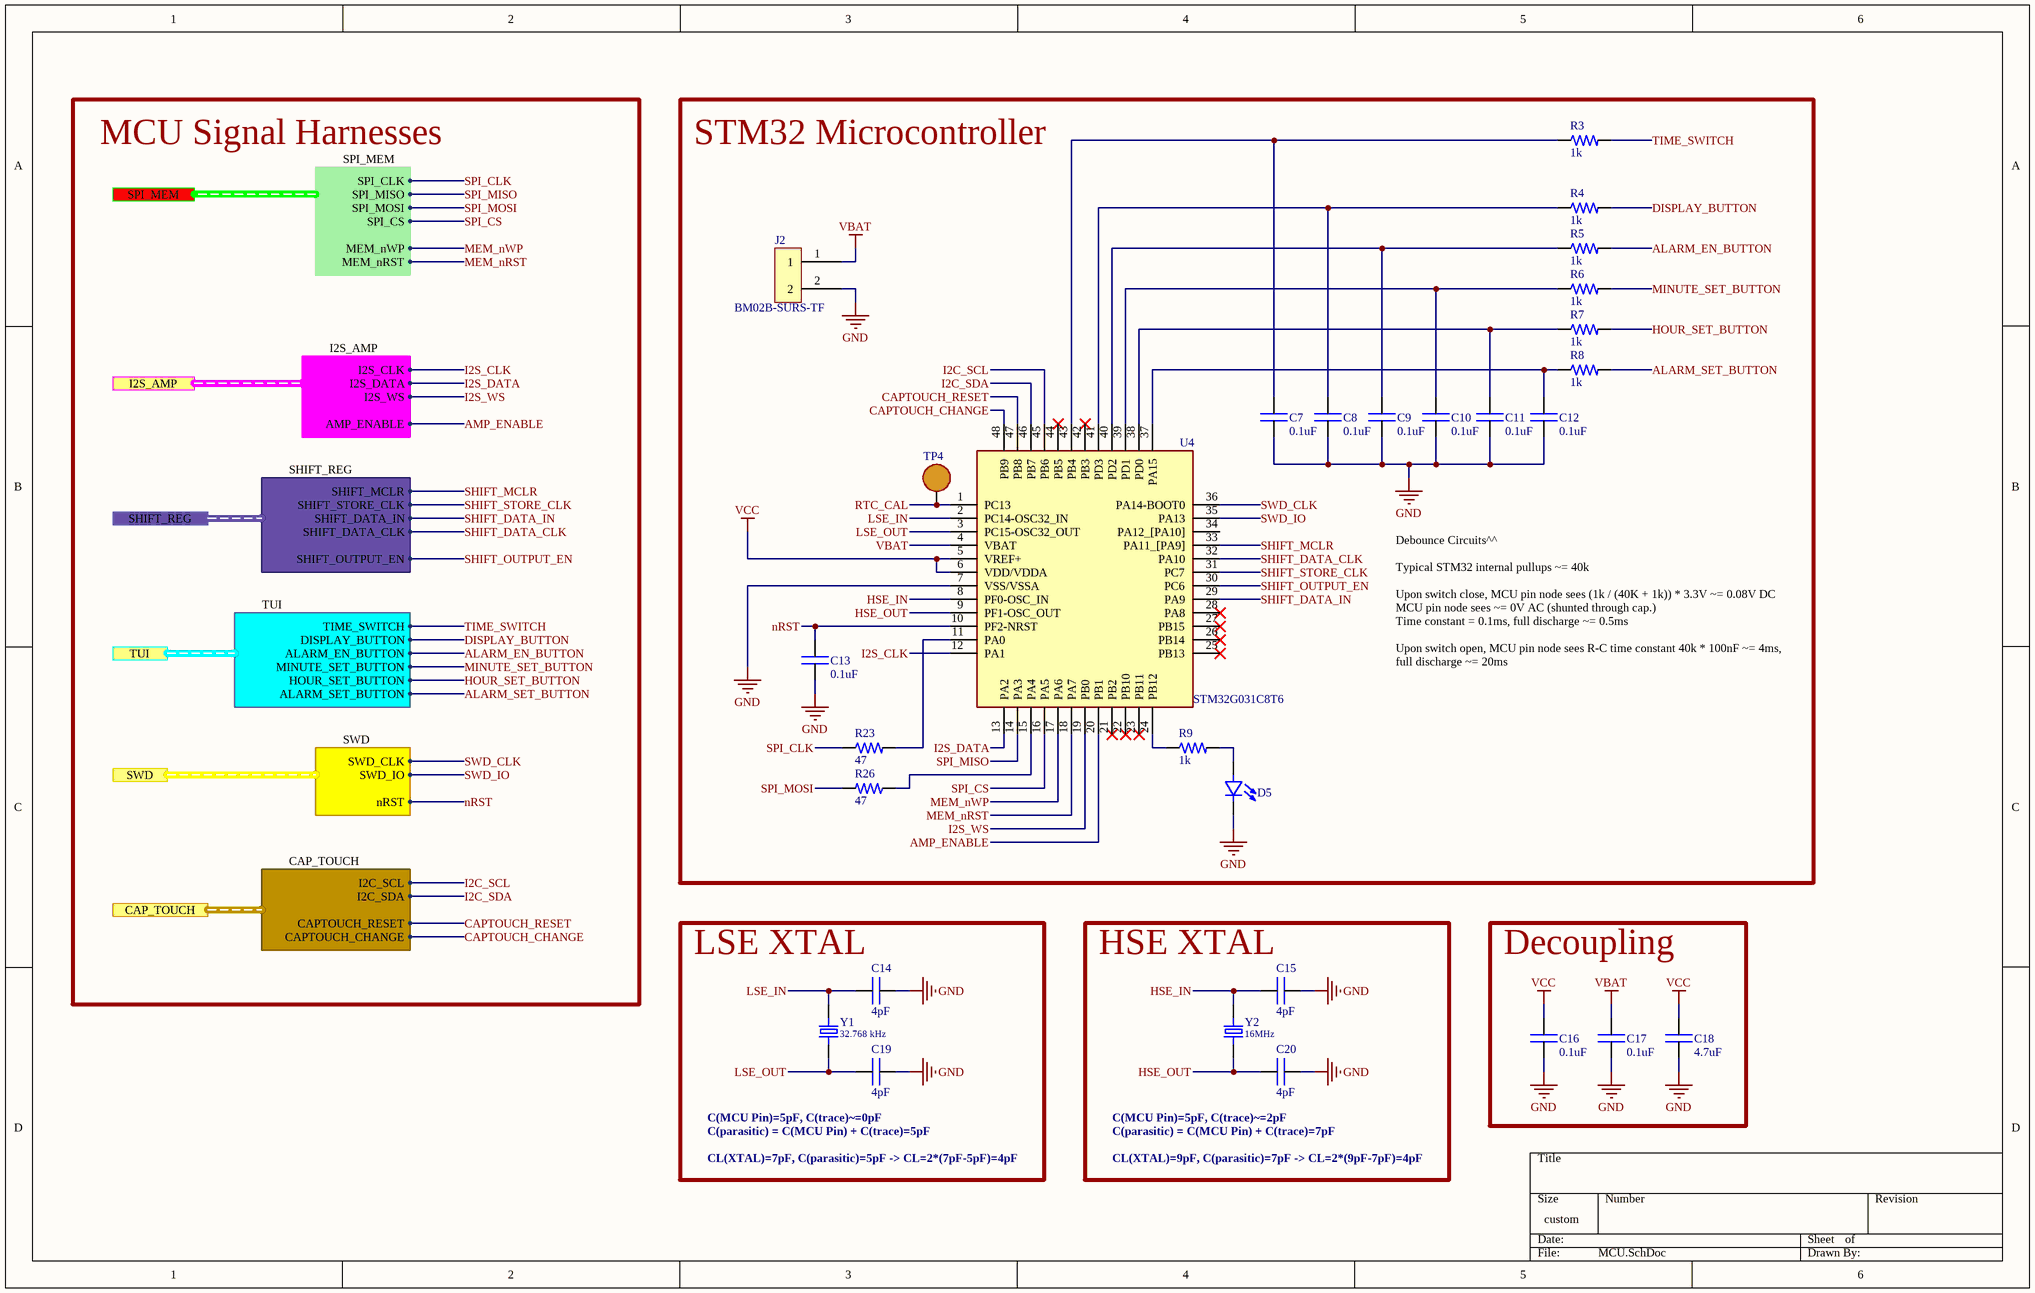
[diagram p11: MCU.SchDoc]

### Parts
C7  value 0.1uF  [0402C]  (hidden comment: CAP)
C8  value 0.1uF  [0402C]  (hidden comment: CAP)
C9  value 0.1uF  [0402C]  (hidden comment: CAP)
C10  value 0.1uF  [0402C]  (hidden comment: CAP)
C11  value 0.1uF  [0402C]  (hidden comment: CAP)
C12  value 0.1uF  [0402C]  (hidden comment: CAP)
C13  value 0.1uF  [0402C]  (hidden comment: CAP)
C14  value 4pF  [0402C]  (hidden comment: CAP)
C15  value 4pF  [0402C]  (hidden comment: CAP)
C16  value 0.1uF  [0402C]  (hidden comment: CAP)
C17  value 0.1uF  [0402C]  (hidden comment: CAP)
C18  value 4.7uF  [0402C]  (hidden comment: CAP)
C19  value 4pF  [0402C]  (hidden comment: CAP)
C20  value 4pF  [0402C]  (hidden comment: CAP)
D5  LED - single  [LED - 0603]  (value not drawn)
J2  BM02B-SURS-TF  [BM02B-SURS-TF]
R3  value 1k  [0402R]  (hidden comment: RES)
R4  value 1k  [0402R]  (hidden comment: RES)
R5  value 1k  [0402R]  (hidden comment: RES)
R6  value 1k  [0402R]  (hidden comment: RES)
R7  value 1k  [0402R]  (hidden comment: RES)
R8  value 1k  [0402R]  (hidden comment: RES)
R9  value 1k  [0402R]  (hidden comment: RES)
R23  value 47  [0402R]  (hidden comment: RES)
R26  value 47  [0402R]  (hidden comment: RES)
TP4  RCWCTE  [RCWCTE]  (value not drawn)
U4  STM32G031C8T6  [48-LQFP]
Y1  32.768 kHz  [ECS-.327-7-12R-TR]
Y2  16MHz  [4-SMD_NL]

### Blocks framed on the sheet
STM32 Microcontroller: C7-C13 D5 J2 R3-R9 R23 R26 TP4 U4
LSE XTAL: C14 C19 Y1
HSE XTAL: C15 C20 Y2
Decoupling: C16-C18

### Ports
CAP_TOUCH (harness CAP_TOUCH, see Brain-PCB_MASTER[3B], Cap-Touch[1B]), I2S_AMP (harness I2S_AMP, see Brain-PCB_MASTER[4B], Amplifier[1B]), SHIFT_REG (harness SHIFT_REG, see Brain-PCB_MASTER[4C], LED-PCB_Connector[2B]), SPI_MEM (harness SPI_MEM, see Brain-PCB_MASTER[3C], Isolation-Buffers[1B]), SWD (harness SWD, see Brain-PCB_MASTER[4C], SWD[2A]), TUI (harness TUI, see Brain-PCB_MASTER[3B], TUI[1B])

### Harnesses
SPI_MEM: SPI_CLK, SPI_MOSI, SPI_CS, SPI_MISO, MEM_nWP, MEM_nRST
I2S_AMP: I2S_CLK, I2S_DATA, I2S_WS, AMP_ENABLE
SHIFT_REG: SHIFT_MCLR, SHIFT_DATA_CLK, SHIFT_STORE_CLK, SHIFT_OUTPUT_EN, SHIFT_DATA_IN
TUI: TIME_SWITCH, DISPLAY_BUTTON, MINUTE_SET_BUTTON, ALARM_EN_BUTTON, HOUR_SET_BUTTON, ALARM_SET_BUTTON
SWD: nRST, SWD_CLK, SWD_IO
CAP_TOUCH: I2C_SCL, I2C_SDA, CAPTOUCH_RESET, CAPTOUCH_CHANGE

### Nets
GND: C7.1 C8.1 C9.1 C10.1 C11.1 C12.1 C13.1 C14.1 C15.1 C16.1 C17.1 C18.1 C19.1 C20.1 D5.2(C) J2.2 U4.7(VSS/VSSA)
VBAT: C17.2 J2.1 U4.4(VBAT)
VCC: C16.2 C18.2 U4.5(VREF+) U4.6(VDD/VDDA)
ALARM_EN_BUTTON: R5.2 ; port TUI.ALARM_EN_BUTTON
ALARM_SET_BUTTON: R8.2 ; port TUI.ALARM_SET_BUTTON
AMP_ENABLE: U4.20(PB1) ; port I2S_AMP.AMP_ENABLE
CAPTOUCH_CHANGE: U4.48(PB9) ; port CAP_TOUCH.CAPTOUCH_CHANGE
CAPTOUCH_RESET: U4.47(PB8) ; port CAP_TOUCH.CAPTOUCH_RESET
DISPLAY_BUTTON: R4.2 ; port TUI.DISPLAY_BUTTON
HOUR_SET_BUTTON: R7.2 ; port TUI.HOUR_SET_BUTTON
HSE_IN: C15.2 U4.8(PF0-OSC_IN) Y2.2
HSE_OUT: C20.2 U4.9(PF1-OSC_OUT) Y2.1
I2C_SCL: U4.45(PB6) ; port CAP_TOUCH.I2C_SCL
I2C_SDA: U4.46(PB7) ; port CAP_TOUCH.I2C_SDA
I2S_CLK: U4.12(PA1) ; port I2S_AMP.I2S_CLK
I2S_DATA: U4.13(PA2) ; port I2S_AMP.I2S_DATA
I2S_WS: U4.19(PB0) ; port I2S_AMP.I2S_WS
LSE_IN: C14.2 U4.2(PC14-OSC32_IN) Y1.2
LSE_OUT: C19.2 U4.3(PC15-OSC32_OUT) Y1.1
MEM_nRST: U4.18(PA7) ; port SPI_MEM.MEM_nRST
MEM_nWP: U4.17(PA6) ; port SPI_MEM.MEM_nWP
MINUTE_SET_BUTTON: R6.2 ; port TUI.MINUTE_SET_BUTTON
nRST: C13.2 U4.10(PF2-NRST) ; port SWD.nRST
RTC_CAL: TP4.1 U4.1(PC13)
SHIFT_DATA_CLK: U4.32(PA10) ; port SHIFT_REG.SHIFT_DATA_CLK
SHIFT_DATA_IN: U4.29(PA9) ; port SHIFT_REG.SHIFT_DATA_IN
SHIFT_MCLR: U4.33(PA11_[PA9]) ; port SHIFT_REG.SHIFT_MCLR
SHIFT_OUTPUT_EN: U4.30(PC6) ; port SHIFT_REG.SHIFT_OUTPUT_EN  [project net SHIFT_nOE]
SHIFT_STORE_CLK: U4.31(PC7) ; port SHIFT_REG.SHIFT_STORE_CLK
SPI_CLK: R23.1 ; port SPI_MEM.SPI_CLK
SPI_CS: U4.16(PA5) ; port SPI_MEM.SPI_CS
SPI_MISO: U4.14(PA3) ; port SPI_MEM.SPI_MISO
SPI_MOSI: R26.2 ; port SPI_MEM.SPI_MOSI
SWD_CLK: U4.36(PA14-BOOT0) ; port SWD.SWD_CLK
SWD_IO: U4.35(PA13) ; port SWD.SWD_IO
TIME_SWITCH: R3.2 ; port TUI.TIME_SWITCH
NetC7_2: C7.2 R3.1 U4.43(PB4)
NetC8_2: C8.2 R4.1 U4.41(PD3)
NetC9_2: C9.2 R5.1 U4.40(PD2)
NetC10_2: C10.2 R6.1 U4.39(PD1)
NetC11_2: C11.2 R7.1 U4.38(PD0)
NetC12_2: C12.2 R8.1 U4.37(PA15)
NetD5_1: D5.1(A) R9.2
NetR9_1: R9.1 U4.24(PB12)
NetR23_2: R23.2 U4.11(PA0)
NetR26_1: R26.1 U4.15(PA4)

Not connected (* = marked no-connect by the designer): U4 21(PB2)* 22(PB10)* 23(PB11)* 25(PB13)* 26(PB14)* 27(PB15)* 28(PA8)* 34(PA12_[PA10]) 42(PB3)* 44(PB5)*

### Notes on the sheet
- MCU Signal Harnesses
- Debounce Circuits^^
  Typical STM32 internal pullups ~= 40k
  Upon switch close, MCU pin node sees (1k / (40K + 1k)) * 3.3V ~= 0.08V DC
  MCU pin node sees ~= 0V AC (shunted through cap.)
  Time constant = 0.1ms, full discharge ~= 0.5ms
  Upon switch open, MCU pin node sees R-C time constant 40k * 100nF ~= 4ms, full discharge ~= 20ms
- CL(XTAL)=7pF, C(parasitic)=5pF -> CL=2*(7pF-5pF)=4pF
- (near C19) C(MCU Pin)=5pF, C(trace)~=0pF
- C(parasitic) = C(MCU Pin) + C(trace)=5pF
- CL(XTAL)=9pF, C(parasitic)=7pF -> CL=2*(9pF-7pF)=4pF
- (near C20) C(MCU Pin)=5pF, C(trace)~=2pF
- C(parasitic) = C(MCU Pin) + C(trace)=7pF

### Library data of the parts
C7-C13 C16 C17 = CAP: as C21 on sheet Cap-Touch; Vendor: *; Vendor PN: *; Vendor Link: *
C14 C15 C19 C20 = CAP: Capacitor; MFR: YAGEO; MFR PN: CC0402CRNPO9BN4R0; Type: SMD; Vendor: *; Vendor PN: *; Vendor Link: *
C18 = CAP: as C25 on sheet Flash-Memory; Vendor: *; Vendor PN: *; Vendor Link: *
D5 = LED - single: LED; MFR: Dialight; MFR PN: 5988070107F; Color: Green; Type: SMD
J2 = CONN 2POS 0.8MM PITCH: CONN HEADER SMD 2POS 0.8MM; MFR: JST; MFR PN: BM02B-SURS-TF; Type: SMD
R3-R9 = RES: as R2 on sheet 3.3V-Regulator; Vendor: *; Vendor PN: *; Vendor Link: *; Type: SMD
R23 R26 = RES: as R19 on sheet Isolation-Buffers; Vendor: *; Vendor PN: *; Vendor Link: *; Type: SMD
TP4 = TEST POINT: as TP8 on sheet Cap-Touch; MFR PN: RCWCTE; Type: SMD
U4 = STM32G031C8T6: ARM® Cortex®-M0+ STM32G0 Microcontroller IC 32-Bit Single-Core 64MHz 64KB (64K x 8) FLASH 48-LQFP (7x7); MFR: STMicroelectronics; MFR PN: STM32G031C8T6; Type: SMD
Y1 = 32.768 kHz XTAL: SMD Tuning Fork Crystal; MFR: ECS Inc.; MFR PN: ECS-.327-7-12R-TR; Vendor: *; Vendor PN: *; Vendor Link: *; Type: SMD; Frequency: 32.768 kHz
Y2 = 16 MHz XTAL: CRYSTAL 16.0000MHZ 9PF SMD; MFR: EPSON; MFR PN: TSX-3225 16.0000MF09Z-AC0; Vendor: *; Vendor PN: *; Vendor Link: *; Type: SMD; Frequency: 16MHz

## Nets that join several sheets
+5: 5V-Regulator (6 pins), LED-PCB_Connector (D26.1 J6.1 J6.2), Amplifier (7 pins)
+12: Power-Input (5 pins), 3.3V-Regulator (D3.K R30.2 U3.1), 5V-Regulator (D1.K R29.2 U2.1)
GND: Cap-Touch (C21.1 U5.2 U5.14), Isolation-Buffers (5 pins), Flash-Memory (10 pins), SWD (D6.2 D7.2 D8.2 J3.5), TUI (12 pins), Power-Input (7 pins), 3.3V-Regulator (5 pins), 5V-Regulator (5 pins), LED-PCB_Connector (8 pins), Amplifier (15 pins), MCU (17 pins)
VCC: Cap-Touch (C21.2 R14.2 R15.2 U5.1), Isolation-Buffers (C22.1 SW7.3 U6.20), Flash-Memory (5 pins), SWD (J3.1), 3.3V-Regulator (6 pins), Amplifier (R28.2), MCU (C16.2 C18.2 U4.5 U4.6)
ALARM_EN_BUTTON: TUI (D12.1 SW2.1), MCU (R5.2)
ALARM_SET_BUTTON: TUI (D11.1 SW3.1), MCU (R8.2)
AMP_ENABLE: Amplifier (U8.3), MCU (U4.20)
CAPTOUCH_CHANGE: Cap-Touch (U5.5), MCU (U4.48)
CAPTOUCH_RESET: Cap-Touch (U5.4), MCU (U4.47)
DISPLAY_BUTTON: TUI (D13.1 SW1.1), MCU (R4.2)
HOUR_SET_BUTTON: TUI (D10.1 SW4.1), MCU (R7.2)
I2C_SCL: Cap-Touch (R15.1 TP8.1 U5.6), MCU (U4.45)
I2C_SDA: Cap-Touch (R14.1 TP9.1 U5.3), MCU (U4.46)
I2S_CLK: Amplifier (TP22.1 U8.6), MCU (U4.12)
I2S_DATA: Amplifier (TP23.1 U8.9), MCU (U4.13)
I2S_WS: Amplifier (TP24.1 U8.7), MCU (U4.19)
MEM_nRST: Isolation-Buffers (U6.17), MCU (U4.18)
MEM_nRST_BUFF: Isolation-Buffers (TP19.1 U6.3), Flash-Memory (D19.1 R25.1 U7.7)
MEM_nWP: Isolation-Buffers (U6.2), MCU (U4.17)
MEM_nWP_BUFF: Isolation-Buffers (TP11.1 U6.18), Flash-Memory (D17.1 R27.1 U7.3)
MINUTE_SET_BUTTON: TUI (D9.1 SW6.1), MCU (R6.2)
nRST: SWD (D6.1 R11.2 TP5.1), MCU (C13.2 U4.10)
SHIFT_DATA_CLK: LED-PCB_Connector (D22.1 J6.4 TP26.1), MCU (U4.32)
SHIFT_DATA_IN: LED-PCB_Connector (D25.1 J6.7 TP25.1), MCU (U4.29)
SHIFT_MCLR: LED-PCB_Connector (D21.1 J6.3 TP28.1), MCU (U4.33)
SHIFT_nOE: LED-PCB_Connector (D24.1 J6.6 TP29.1), MCU (U4.30)
SHIFT_STORE_CLK: LED-PCB_Connector (D23.1 J6.5 TP27.1), MCU (U4.31)
SPI_CLK: Isolation-Buffers (TP16.1 U6.8), MCU (R23.1)
SPI_CLK_BUFF: Isolation-Buffers (R19.1 TP20.1), Flash-Memory (D18.1 U7.6)
SPI_CS: Isolation-Buffers (TP12.1 U6.4), MCU (U4.16)
SPI_CS_BUFF: Isolation-Buffers (TP13.1 U6.16), Flash-Memory (D15.1 R24.1 U7.1)
SPI_MISO: Isolation-Buffers (R21.1 TP14.1), MCU (U4.14)
SPI_MISO_BUFF: Isolation-Buffers (TP21.1 U6.13), Flash-Memory (D16.1 R31.1)
SPI_MOSI: Isolation-Buffers (TP15.1 U6.6), MCU (R26.2)
SPI_MOSI_BUFF: Isolation-Buffers (R20.1 TP17.1), Flash-Memory (D20.1 U7.5)
SWD_CLK: SWD (D7.1 R12.1 TP7.1), MCU (U4.36)
SWD_IO: SWD (D8.1 R10.1 TP6.1), MCU (U4.35)
TIME_SWITCH: TUI (D14.1 SW5.2), MCU (R3.2)